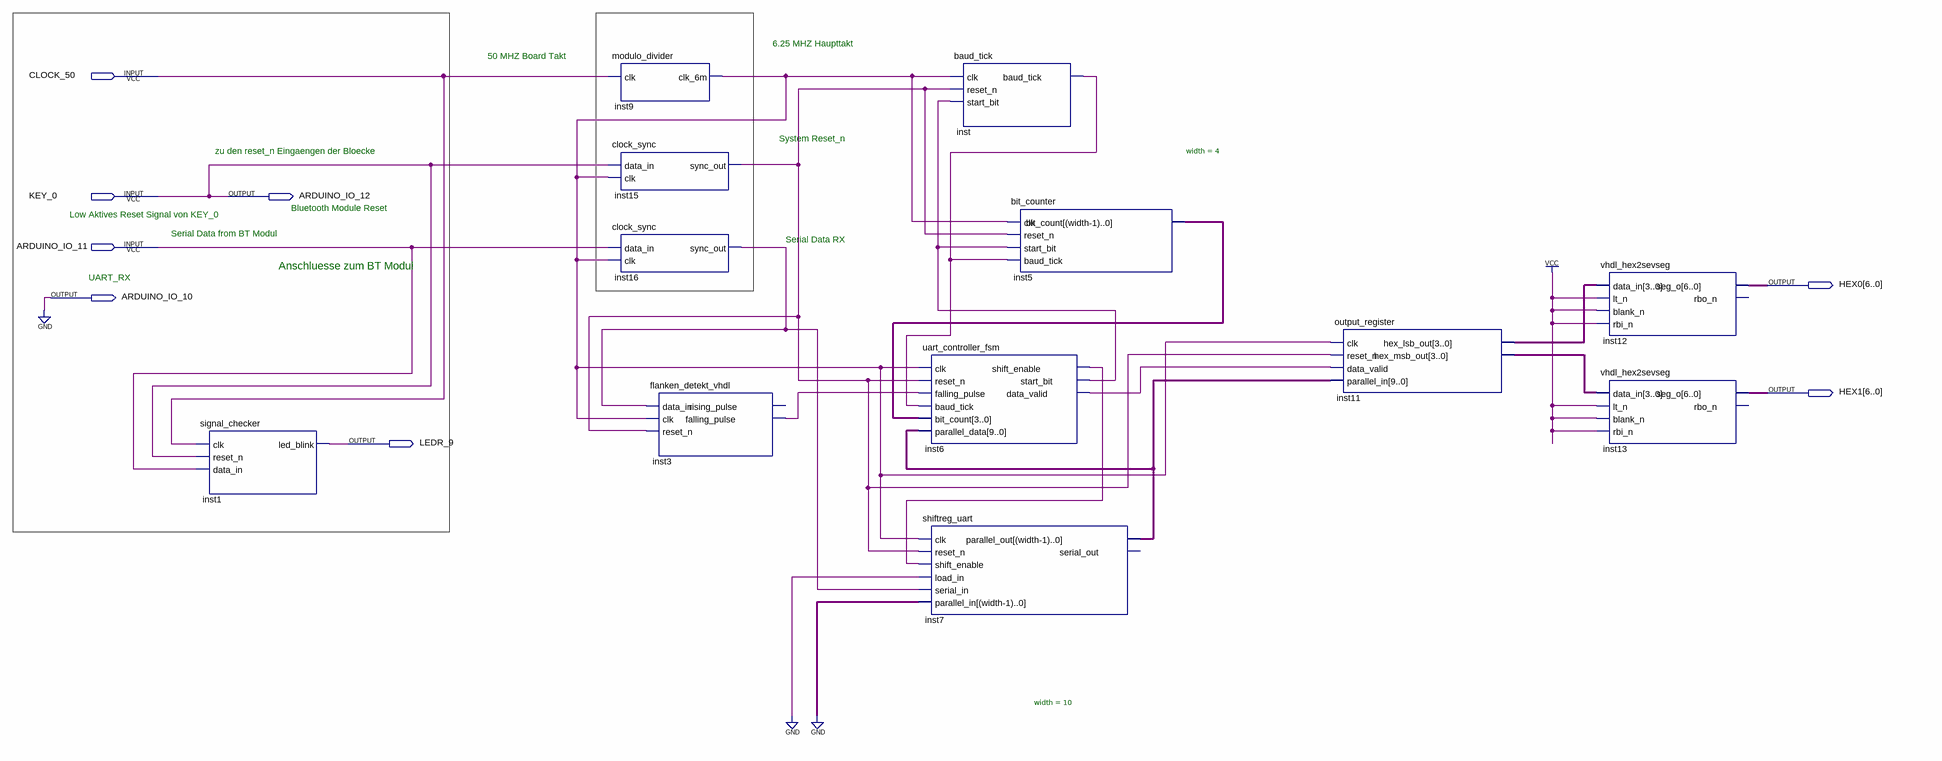
[diagram p0: schematic sheet]
// Quartus schematic uart_top.bdf as structural Verilog: 12 symbols, 8 pins
module uart_top (
  input  CLOCK_50,
  input  KEY_0,
  input  ARDUINO_IO_11,
  output ARDUINO_IO_12,
  output [6:0] HEX0,
  output ARDUINO_IO_10,
  output [6:0] HEX1,
  output LEDR_9
);

  wire inst3_falling_pulse, inst6_data_valid, inst6_shift_enable, inst6_start_bit, inst9_clk_6m,
       inst15_sync_out, inst16_sync_out, inst_baud_tick;
  wire [3:0] inst5_bit_count, inst11_hex_lsb_out, inst11_hex_msb_out;
  wire [9:0] inst7_parallel_out;

  signal_checker inst1 (.clk(CLOCK_50), .reset_n(KEY_0), .data_in(ARDUINO_IO_11), .led_blink(LEDR_9));
  modulo_divider inst9 (.clk(CLOCK_50), .clk_6m(inst9_clk_6m));
  clock_sync inst15 (.data_in(KEY_0), .clk(inst9_clk_6m), .sync_out(inst15_sync_out));
  clock_sync inst16 (.data_in(ARDUINO_IO_11), .clk(inst9_clk_6m), .sync_out(inst16_sync_out));
  flanken_detekt_vhdl inst3 (
    .data_in(inst16_sync_out), .clk(inst9_clk_6m), .reset_n(inst15_sync_out),
    .falling_pulse(inst3_falling_pulse));  // open: rising_pulse
  baud_tick inst (
    .clk(inst9_clk_6m), .reset_n(inst15_sync_out), .start_bit(inst6_start_bit), .baud_tick(inst_baud_tick));
  uart_controller_fsm inst6 (
    .clk(inst9_clk_6m), .reset_n(inst15_sync_out), .falling_pulse(inst3_falling_pulse),
    .baud_tick(inst_baud_tick), .bit_count(inst5_bit_count), .parallel_data(inst7_parallel_out),
    .shift_enable(inst6_shift_enable), .start_bit(inst6_start_bit), .data_valid(inst6_data_valid));
  shiftreg_uart #(.width(10)) inst7 (
    .clk(inst9_clk_6m), .reset_n(inst15_sync_out), .shift_enable(inst6_shift_enable), .load_in(1'b0),
    .serial_in(inst16_sync_out), .parallel_in({10{1'b0}}), .parallel_out(inst7_parallel_out));  // open: serial_out
  bit_counter #(.width(4)) inst5 (
    .clk(inst9_clk_6m), .reset_n(inst15_sync_out), .start_bit(inst6_start_bit), .baud_tick(inst_baud_tick),
    .bit_count(inst5_bit_count));
  output_register inst11 (
    .clk(inst9_clk_6m), .reset_n(inst15_sync_out), .data_valid(inst6_data_valid),
    .parallel_in(inst7_parallel_out), .hex_lsb_out(inst11_hex_lsb_out), .hex_msb_out(inst11_hex_msb_out));
  vhdl_hex2sevseg inst12 (
    .data_in(inst11_hex_lsb_out), .lt_n(1'b1), .blank_n(1'b1), .rbi_n(1'b1), .seg_o(HEX0));  // open: rbo_n
  vhdl_hex2sevseg inst13 (
    .data_in(inst11_hex_msb_out), .lt_n(1'b1), .blank_n(1'b1), .rbi_n(1'b1), .seg_o(HEX1));  // open: rbo_n

  assign ARDUINO_IO_10 = 1'b0;
  assign ARDUINO_IO_12 = KEY_0;

  // Notes on the sheet:
  //   6.25 MHZ Haupttakt
  //   50 MHZ Board Takt
  //   System Reset_n
  //   zu den reset_n Eingaengen der Bloecke
  //   Bluetooth Module Reset
  //   Low Aktives Reset Signal von KEY_0
  //   Serial Data from BT Modul
  //   Serial Data RX 
  //   Anschluesse zum BT Modul
  //   UART_RX
endmodule
